# EAGLE design Natcar 1.01 (EAGLE 7.2.0)
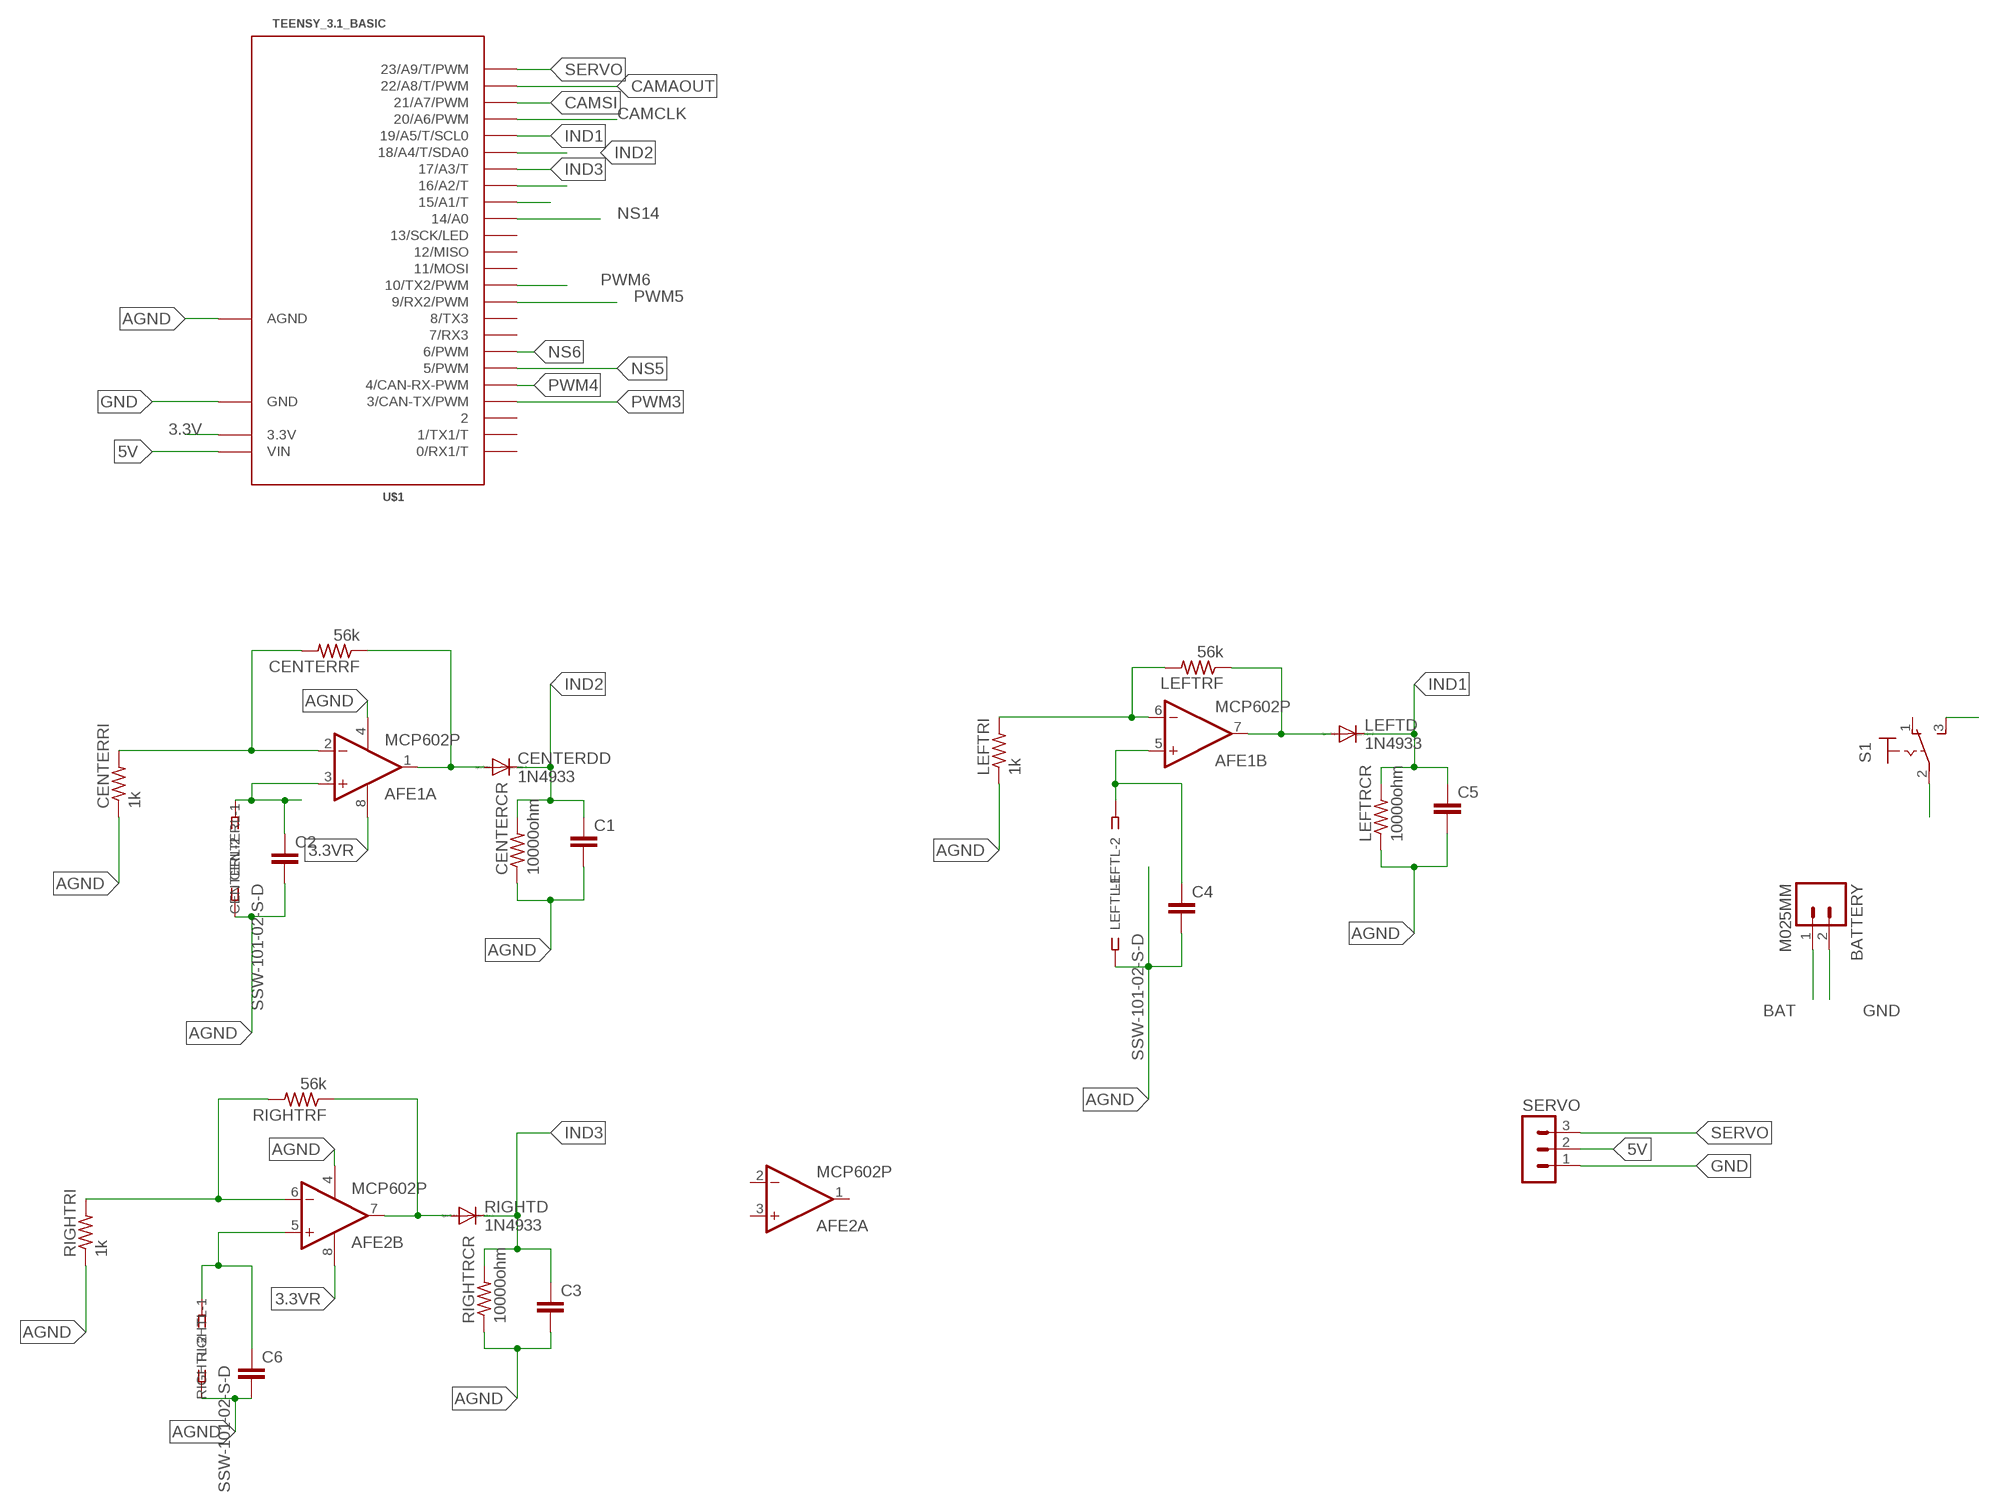
[diagram p0: schematic, sheet 1, part 1 of 2]
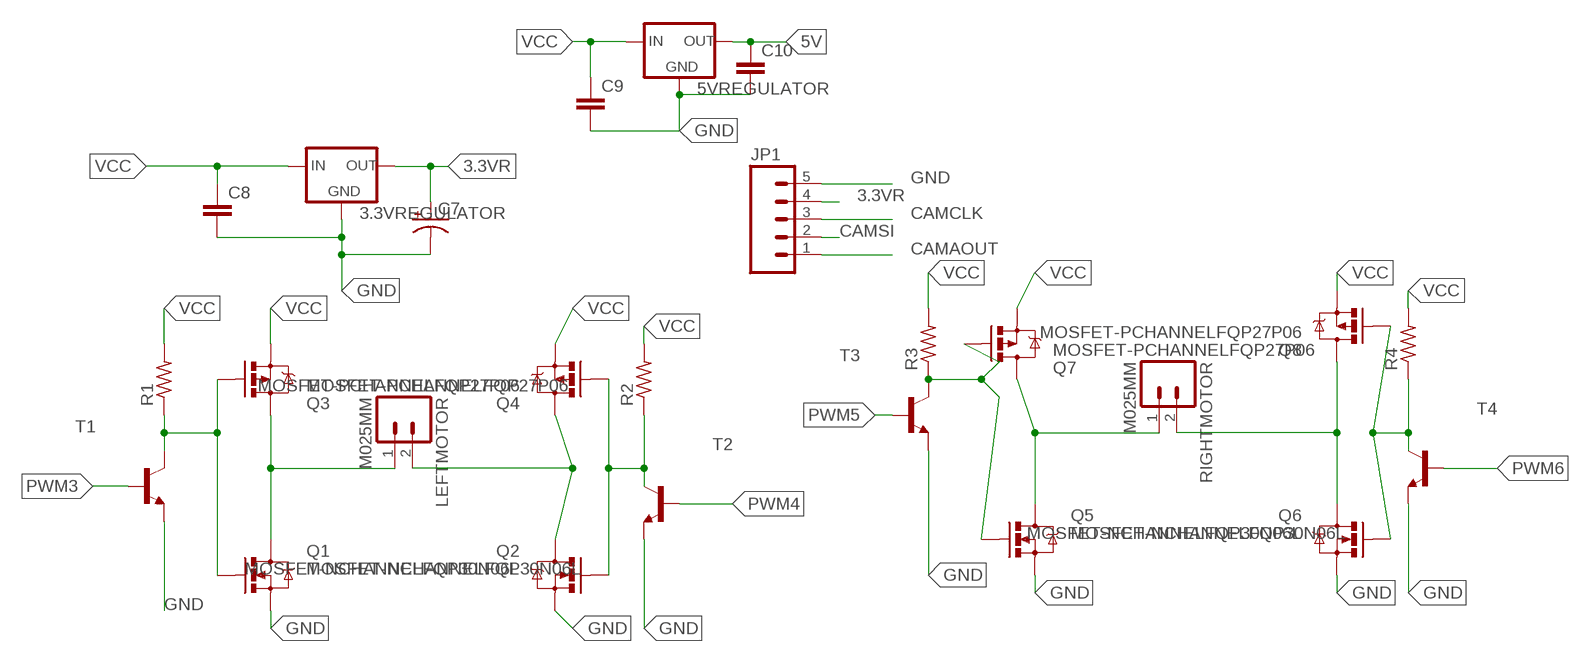
[diagram p1: schematic, sheet 1, part 2 of 2]

## Parts
3.3VREGULATOR  V_REG_78XXSINK  [TO220-IGO]
5VREGULATOR  V_REG_78XXSINK  [TO220-IGO]
AFE1  MCP602P  [DIL08]
AFE2  MCP602P  [DIL08]
BATTERY  M025MM  [SCREWTERMINAL-5MM-2]
C1  CAPEZ  [CAP-PTH-SMALLEZ]
C2  CAPEZ  [CAP-PTH-SMALLEZ]
C3  CAPEZ  [CAP-PTH-SMALLEZ]
C4  CAPEZ  [CAP-PTH-SMALLEZ]
C5  CAPEZ  [CAP-PTH-SMALLEZ]
C6  CAPEZ  [CAP-PTH-SMALLEZ]
C7  CAP_POLPTH2  [CPOL-RADIAL-10UF-25V]
C8  CAPPTH2  [CAP-PTH-SMALL2]
C9  CAPPTH2  [CAP-PTH-SMALL2]
C10  CAPPTH2  [CAP-PTH-SMALL2]
CENTERCR  10000ohm  R-US_0204/5  [0204/5]
CENTERDD  1N4933  [DO41-10]
CENTERL  SSW-101-02-S-D  [SSW-101-02-S-D]
CENTERRF  56k  R-US_0204/5  [0204/5]
CENTERRI  1k  R-US_0204/5  [0204/5]
JP1  M05PTH  [1X05]
LEFTD  1N4933  [DO41-10]
LEFTL  SSW-101-02-S-D  [SSW-101-02-S-D]
LEFTMOTOR  M025MM  [SCREWTERMINAL-5MM-2]
LEFTRCR  10000ohm  R-US_0204/5  [0204/5]
LEFTRF  56k  R-US_0204/5  [0204/5]
LEFTRI  1k  R-US_0204/5  [0204/5]
Q1  MOSFET-NCHANNELFQP30N06L  [TO220V]
Q2  MOSFET-NCHANNELFQP30N06L  [TO220V]
Q3  MOSFET-PCHANNELFQP27P06  [TO220V]
Q4  MOSFET-PCHANNELFQP27P06  [TO220V]
Q5  MOSFET-NCHANNELFQP30N06L  [TO220V]
Q6  MOSFET-NCHANNELFQP30N06L  [TO220V]
Q7  MOSFET-PCHANNELFQP27P06  [TO220V]
Q8  MOSFET-PCHANNELFQP27P06  [TO220V]
R1  R-US_0204/5  [0204/5]
R2  R-US_0204/5  [0204/5]
R3  R-US_0204/5  [0204/5]
R4  R-US_0204/5  [0204/5]
RIGHTD  1N4933  [DO41-10]
RIGHTL  SSW-101-02-S-D  [SSW-101-02-S-D]
RIGHTMOTOR  M025MM  [SCREWTERMINAL-5MM-2]
RIGHTRCR  10000ohm  R-US_0204/5  [0204/5]
RIGHTRF  56k  R-US_0204/5  [0204/5]
RIGHTRI  1k  R-US_0204/5  [0204/5]
S1  320-916  [320-916]
SERVO  MA03-1  [MA03-1]
T1  -NPN-TO92-EBC  [TO92-EBC]
T2  -NPN-TO92-EBC  [TO92-EBC]
T3  -NPN-TO92-EBC  [TO92-EBC]
T4  -NPN-TO92-EBC  [TO92-EBC]
U$1  TEENSY_3.1_BASIC  [TEENSY_3.1_BASIC]

## Nets
3.3V: U$1.3.3V
3.3VR: 3.3VREGULATOR.OUT AFE1.8(P:V+) AFE2.8(P:V+) C7.1(+) JP1.4
5V: 5VREGULATOR.OUT C10.1 SERVO.2 U$1.VIN
AGND: AFE1.4(P:V-) AFE2.4(P:V-) C1.2 C2.2 C3.2 C4.2 C5.2 C6.2 CENTERCR.1 CENTERL.1 CENTERRI.1 LEFTL.1 LEFTRCR.1 LEFTRI.1 RIGHTL.1 RIGHTRCR.1 RIGHTRI.1 U$1.AGND
BAT: BATTERY.1 S1.3(S)
CAMAOUT: JP1.1 U$1.22/A8(22/A8/T/PWM)
CAMCLK: JP1.3 U$1.20/A6(20/A6/PWM)
CAMSI: JP1.2 U$1.21/A7(21/A7/PWM)
GND: 3.3VREGULATOR.GND 5VREGULATOR.GND BATTERY.2 C7.2(-) C8.2 C9.2 C10.2 JP1.5 Q1.3(S) Q2.3(S) Q5.3(S) Q6.3(S) SERVO.1 T1.E T2.E T3.E T4.E U$1.GND
IND1: C5.1 LEFTD.C LEFTRCR.2 U$1.19/A5(19/A5/T/SCL0)
IND2: C1.1 CENTERCR.2 CENTERDD.C U$1.18/A4(18/A4/T/SDA0)
IND3: C3.1 RIGHTD.C RIGHTRCR.2 U$1.17/A3(17/A3/T)
N$1: LEFTMOTOR.2 Q2.2(D) Q4.2(D)
N$2: Q2.1(G) Q4.1(G) R2.1 T2.C
N$3: Q5.2(D) Q7.2(D) RIGHTMOTOR.1
N$4: Q6.2(D) Q8.2(D) RIGHTMOTOR.2
N$5: Q1.1(G) Q3.1(G) R1.1 T1.C
N$6: Q5.1(G) Q7.1(G) R3.1 T3.C
N$7: Q6.1(G) Q8.1(G) R4.1 T4.C
N$8: LEFTMOTOR.1 Q1.2(D) Q3.2(D)
N$9: AFE2.6(B:-IN) RIGHTRF.2 RIGHTRI.2
N$10: AFE2.7(B:OUT) RIGHTD.A RIGHTRF.1
N$11: U$1.15/A1(15/A1/T)
N$12: AFE1.2(A:-IN) CENTERRF.2 CENTERRI.2
N$13: AFE1.3(A:+IN) C2.1 CENTERL.2
N$14: U$1.16/A2(16/A2/T)
N$17: AFE2.5(B:+IN) C6.1 RIGHTL.2
N$19: AFE1.1(A:OUT) CENTERDD.A CENTERRF.1
N$20: AFE1.7(B:OUT) LEFTD.A LEFTRF.1
N$21: AFE1.5(B:+IN) C4.1 LEFTL.2
N$22: AFE1.6(B:-IN) LEFTRF.2 LEFTRI.2
NS5: U$1.5(5/PWM)
NS6: U$1.6(6/PWM)
NS14: U$1.14/A0
PWM3: T1.B U$1.3(3/CAN-TX/PWM)
PWM4: T2.B U$1.4(4/CAN-RX-PWM)
PWM5: T3.B U$1.9(9/RX2/PWM)
PWM6: T4.B U$1.10(10/TX2/PWM)
SERVO: SERVO.3 U$1.23/A9(23/A9/T/PWM)
VCC: 3.3VREGULATOR.IN 5VREGULATOR.IN C8.1 C9.1 Q3.3(S) Q4.3(S) Q7.3(S) Q8.3(S) R1.2 R2.2 R3.2 R4.2 S1.2(P)
Unconnected: AFE2.1(A:OUT) AFE2.2(A:-IN) AFE2.3(A:+IN) S1.1(O) U$1.0(0/RX1/T) U$1.1(1/TX1/T) U$1.2 U$1.7(7/RX3) U$1.8(8/TX3) U$1.11(11/MOSI) U$1.12(12/MISO) U$1.13(13/SCK/LED)

## Library data of the parts
3.3VREGULATOR 5VREGULATOR = SparkFun-PowerIC:V_REG_78XX: Voltage Regulator Standard 7805 5V regulator. IGO (Input Ground Output). Spark Fun Electronics SKU : COM-00107
AFE1 AFE2 = linear:MCP602: Single Op Amp 2.7V to 6.0V Single Supply CMOS Source: http://ww1.microchip.com/downloads/en/DeviceDoc/21314g.pdf
BATTERY LEFTMOTOR RIGHTMOTOR = SparkFun-Connectors:M02: Standard 2-pin 0.1" header. Use with - straight break away headers ( PRT-00116) - right angle break away headers (PRT-00553) - swiss pins (PRT-00743) - machine pins (PRT-00117) - female headers (PRT-00115) Molex polarized connector foot print use with: PRT-08233 with associated crimp pins and housings. 2.54_SCREWTERM for use with PRT-10571. 3.5mm Screw Terminal footprints for PRT-08084 5mm Screw Terminal footprints for use with PRT-08432; STOREFRONT_ID: PRT-08432
C1-C6 C8-C10 = SparkFun-Passives:CAP: Capacitor Standard 0603 ceramic capacitor, and 0.1" leaded capacitor.
C7 = SparkFun-Passives:CAP_POL: Capacitor Polarized These are standard SMD and PTH capacitors. Normally 10uF, 47uF, and 100uF in electrolytic and tantalum varieties. Always verify the external diameter of the through hole cap, it varies with capacity, voltage, and manufacturer. The EIA devices should be standard.
CENTERCR CENTERRF CENTERRI LEFTRCR LEFTRF LEFTRI R1-R4 RIGHTRCR RIGHTRF RIGHTRI = resistor:R-US_: RESISTOR, American symbol
CENTERDD LEFTD RIGHTD = diode:1N4933: DIODE fast recovery rectifier, 1A
CENTERL LEFTL RIGHTL = con-samtec:SSW-101-02-S-D: THROUGH-HOLE .025" SQ POST SOCKET Source: Samtec SSW.pdf; MPN: SSW-101-02-S-D; OC_FARNELL: unknown; OC_NEWARK: 82P1456
JP1 = SparkFun-Connectors:M05: Header 5 Standard 5-pin 0.1" header. Use with straight break away headers (SKU : PRT-00116), right angle break away headers (PRT-00553), swiss pins (PRT-00743), machine pins (PRT-00117), and female headers (PRT-00115). Molex polarized connector foot print use with SKU : PRT-08230 with associated crimp pins and housings.
Q1 Q2 Q5 Q6 = SparkFun-DiscreteSemi:MOSFET-NCHANNEL: Common NMOSFET Parts MFG P/N Store ID Prod ID FDD8780 TRANS-09984 SI7820DN TRANS-11055 FDS6630A IC-08089 2N7002PW TRANS-11151 FQP30N06L COM-10213 TRANS-10060 BSS123LT1G TRANS-08345 BSS138 TRANS-00830 BS170 2N7000; PROD_ID: TRANS-10060
Q3 Q4 Q7 Q8 = SparkFun-DiscreteSemi:MOSFET-PCHANNEL: Generic PMOSFET IRLML2244 - TRANS-11153 (SOT-23 -20V -4.3A) (1.Gate 2.Source 3.Drain) FQP27P06 - COM-10349 <http://www.sparkfun.com/products/10349> (TO-220 -60V -27A) (1.Gate 2.Source 3.Drain)
S1 = switch:320-916: TOGGLE SWITCH distributor RS Components
SERVO = con-lstb:MA03-1: PIN HEADER; OC_FARNELL: unknown; OC_NEWARK: unknown
T1-T4 = transistor:*-NPN-: NPN Transistror BF959 corrected 2008.03.06
U$1 = Modified teensy 3.1:TEENSY_3.1_BASIC: Footprint for Teensy 3.1 board using all pin connections on the outer perimeter

## Net classes
0 default: clearance 0.205 mm

## Board
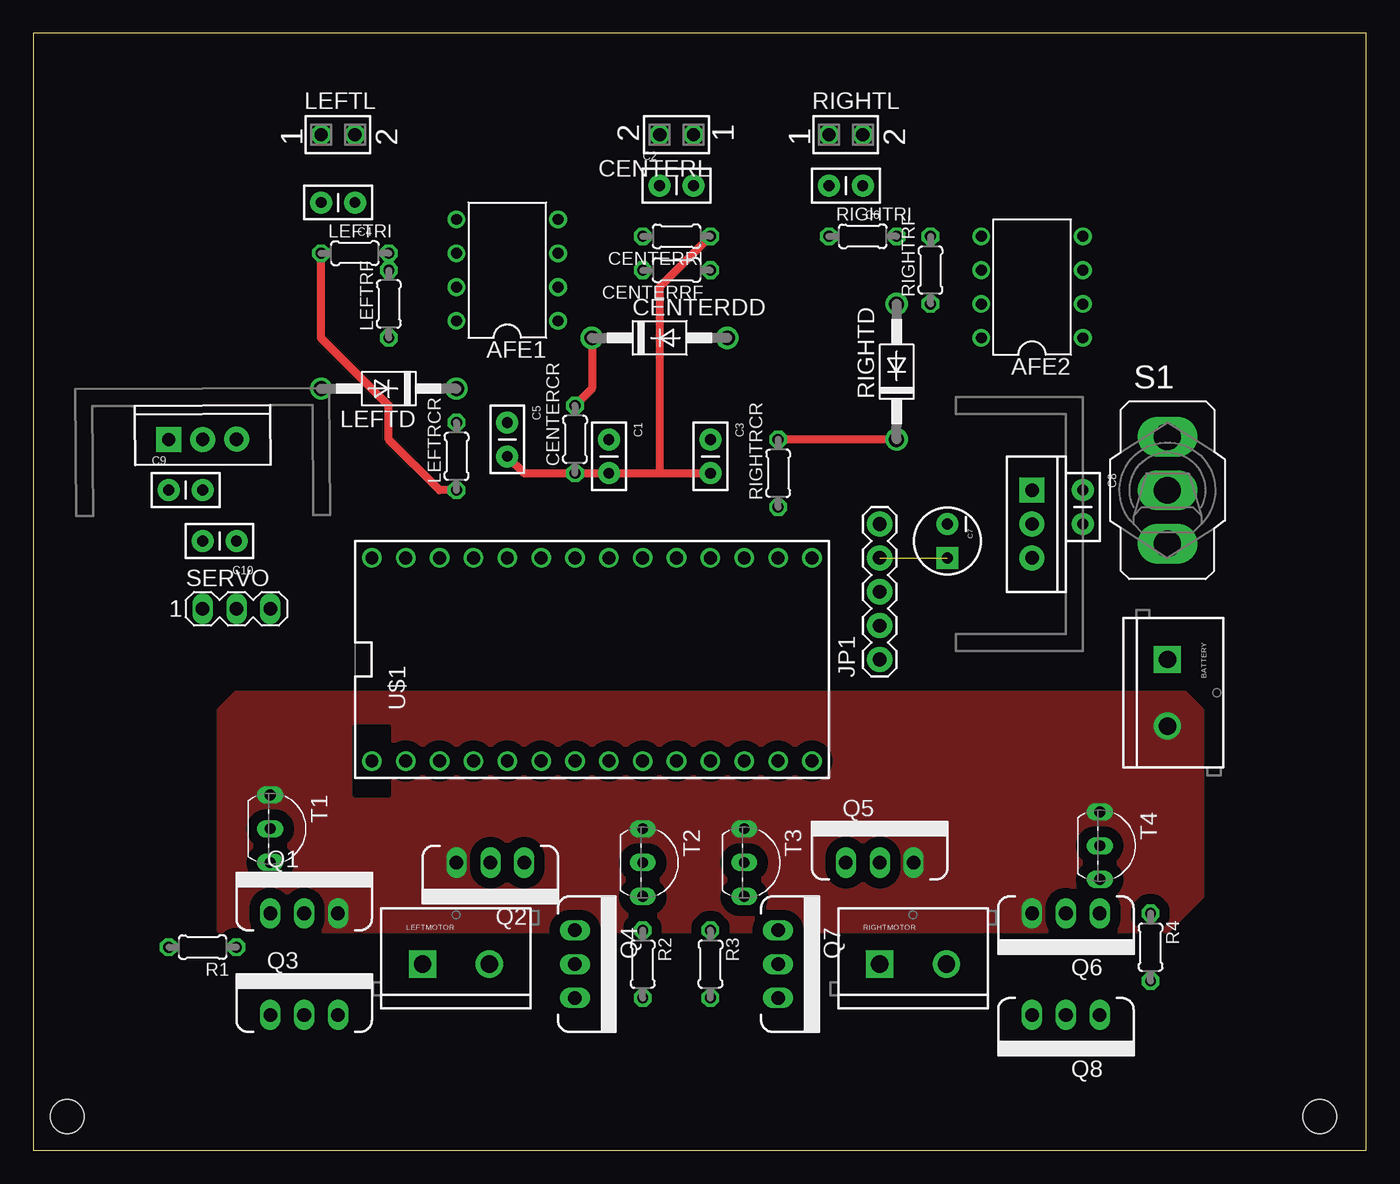
[diagram p2: board, top side]
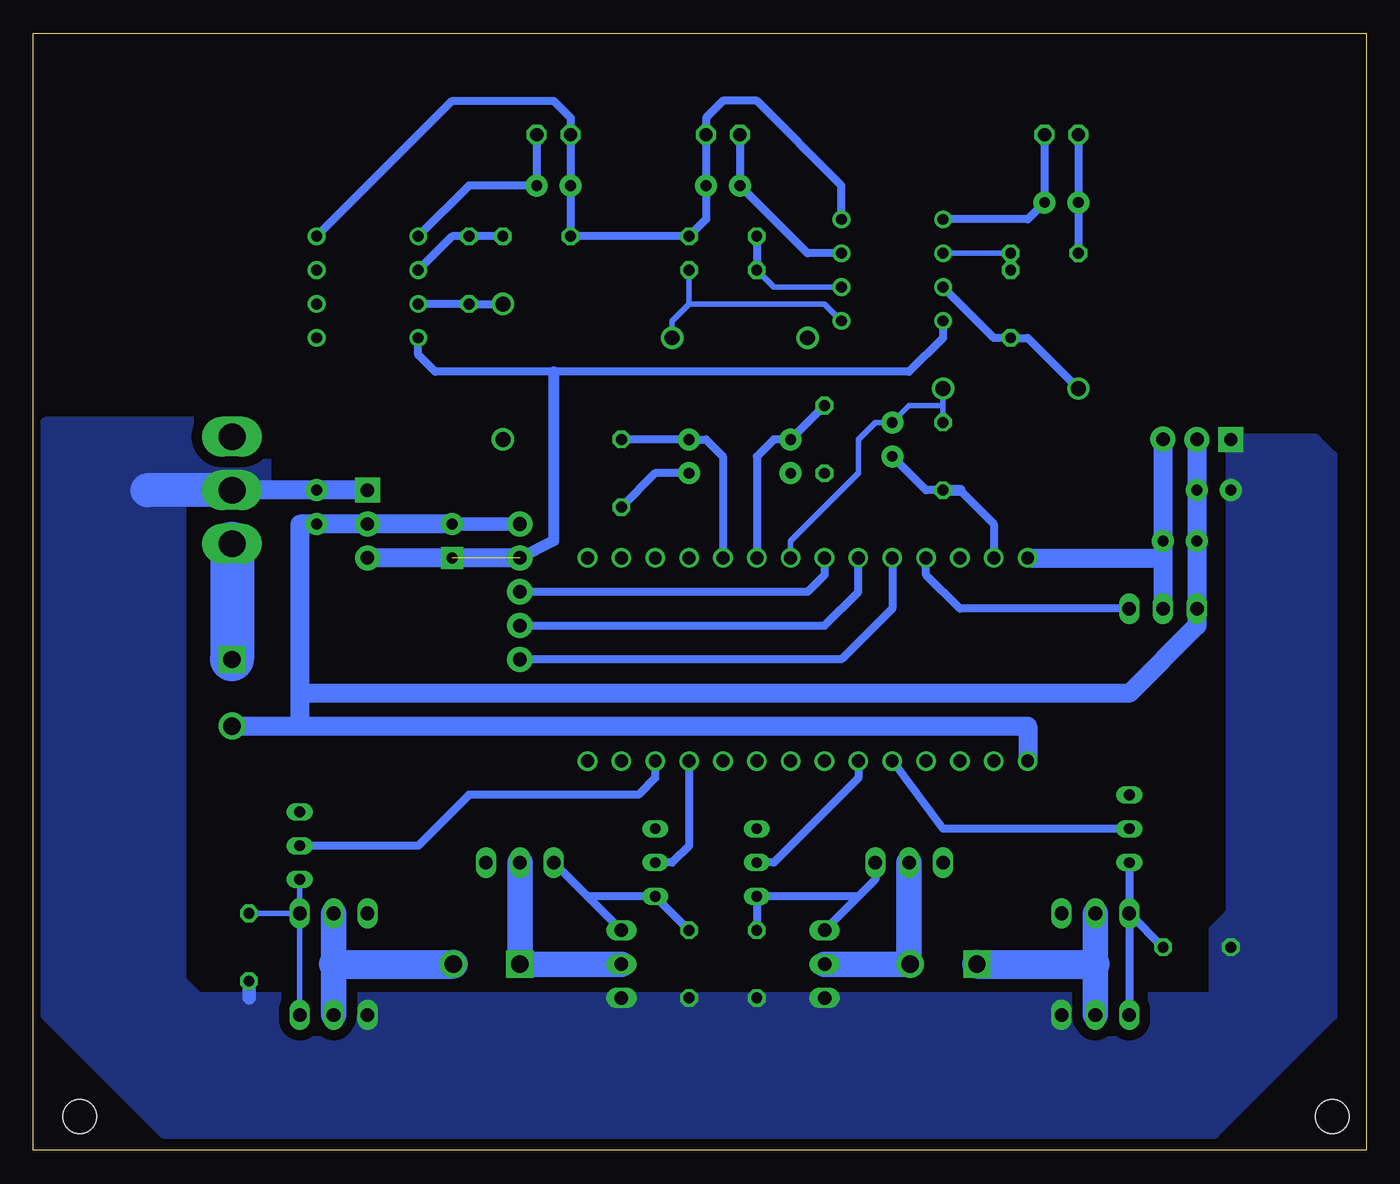
[diagram p3: board, bottom side, seen from below]

Size 100 x 83.81 mm. Coordinates in mm from the lower left corner, seen from the top.
Outline: 0,0 100,0 100,83.81 0,83.81 0,0
Copper layers (1*16): Top 0.035mm / dielectric 1.5mm / Bottom 0.035mm
Design rules "Othermill-DRC-1-32": minimum track width 8mil, minimum drill 0.8mm, track to track 0.794003125mm, track to pad 0.794003125mm, pad to pad 0.794003125mm, via to via 0.794003125mm, smd to smd 0mil, copper to edge 0mil, drill to drill 1mil, minimum pad ring 10mil, minimum via ring 10mil, stop-mask expansion 1mil, vias tented up to drill 30mil, thermal gap 10mil
Holes 2.54 mm at 2.54,2.54 96.52,2.54

### Footprints (pad centres in the part's own frame; a part is rotated, then mirrored left to right if it is on the bottom)
TO220-IGO = drill 1 pad 1.88: GND 0,0; OUT 2.54,0 | drill 1 pad 1.88 square: IN -2.54,0
DIL08 = drill 0.813 pad 1.27: 1 -3.81,-3.81; 2 -1.27,-3.81; 3 1.27,-3.81; 4 3.81,-3.81; 5 3.81,3.81; 6 1.27,3.81; 7 -1.27,3.81; 8 -3.81,3.81
SCREWTERMINAL-5MM-2 = drill 1.3 pad 2.032 square: 1 0,0 | drill 1.3 pad 2.032: 2 5,0
CAP-PTH-SMALLEZ = drill 0.813 pad 1.651: 1 0,0; 2 2.54,0
CPOL-RADIAL-10UF-25V = drill 0.813 pad 1.651 square: 1 1.27,0 | drill 0.813 pad 1.651: 2 -1.27,0
CAP-PTH-SMALL2 = drill 0.813 pad 1.651: 1 0,0; 2 2.54,0
0204/5 = drill 0.813 octagon: 1 -2.54,0; 2 2.54,0
DO41-10 = drill 1.118: A 5.08,0; C -5.08,0
SSW-101-02-S-D = drill 1 pad 1.5 octagon: 1 0,-1.27; 2 0,1.27
1X05 = drill 1.016 pad 1.88: 1 0,0; 2 2.54,0; 3 5.08,0; 4 7.62,0; 5 10.16,0
TO220V = drill 1.016 long: 1 -2.54,0; 2 0,0; 3 2.54,0
320-916 = drill 2.007 long: 1 0,4.013; 2 0,0; 3 0,-4.013
MA03-1 = drill 1.016 long: 1 -2.54,0; 2 0,0; 3 2.54,0
TO92-EBC = drill 0.813 long: B 0,-1.27; C 2.54,-1.27; E -2.54,-1.27
TEENSY_3.1_BASIC = drill 0.965: 0 -7.62,13.97; 1 -7.62,11.43; 2 -7.62,8.89; 3 -7.62,6.35; 3.3V 7.62,11.43; 4 -7.62,3.81; 5 -7.62,1.27; 6 -7.62,-1.27; 7 -7.62,-3.81; 8 -7.62,-6.35; 9 -7.62,-8.89; 10 -7.62,-11.43; 11 -7.62,-13.97; 12 -7.62,-16.51; 13 7.62,-16.51; 14/A0 7.62,-13.97; 15/A1 7.62,-11.43; 16/A2 7.62,-8.89; 17/A3 7.62,-6.35; 18/A4 7.62,-3.81; 19/A5 7.62,-1.27; 20/A6 7.62,1.27; 21/A7 7.62,3.81; 22/A8 7.62,6.35; 23/A9 7.62,8.89; AGND 7.62,13.97; GND -7.62,16.51; VIN 7.62,16.51

### Placement (x,y rotation side)
3.3VREGULATOR  74.93,46.99 270 top
5VREGULATOR  12.7,53.34 0.3 top
AFE1  35.56,66.04 90 top
AFE2  74.93,64.77 90 top
BATTERY  85.09,36.83 270 top
C1  43.18,53.34 270 top
C2  46.99,72.39 0 top
C3  50.8,53.34 270 top
C4  24.13,71.12 180 top
C5  35.56,54.61 270 top
C6  62.23,72.39 180 top
C7  68.58,45.72 270 top
C8  78.74,49.53 270 top
C9  10.16,49.53 0 top
C10  15.24,45.72 180 top
CENTERCR  40.64,53.34 90 top
CENTERDD  46.99,60.96 0 top
CENTERL  48.26,76.2 90 top
CENTERRF  48.26,66.04 180 top
CENTERRI  48.26,68.58 180 top
JP1  63.5,36.83 90 top
LEFTD  26.67,57.15 180 top
LEFTL  22.86,76.2 270 top
LEFTMOTOR  29.21,13.97 0 top
LEFTRCR  31.75,52.07 90 top
LEFTRF  26.67,63.5 90 top
LEFTRI  24.13,67.31 0 top
Q1  20.32,17.78 0 top
Q2  34.29,21.59 180 top
Q3  20.32,10.16 0 top
Q4  40.64,13.97 270 top
Q5  63.5,21.59 0 top
Q6  77.47,17.78 180 top
Q7  55.88,13.97 270 top
Q8  77.47,10.16 180 top
R1  12.7,15.24 180 top
R2  45.72,13.97 270 top
R3  50.8,13.97 270 top
R4  83.82,15.24 270 top
RIGHTD  64.77,58.42 90 top
RIGHTL  60.96,76.2 270 top
RIGHTMOTOR  63.5,13.97 0 top
RIGHTRCR  55.88,50.8 90 top
RIGHTRF  67.31,66.04 90 top
RIGHTRI  62.23,68.58 0 top
S1  85.09,49.53 0 top
SERVO  15.24,40.64 0 top
T1  19.05,24.13 270 top
T2  46.99,21.59 270 top
T3  54.61,21.59 270 top
T4  81.28,22.86 270 top
U$1  41.91,36.83 90 top

### Tracks (layer width: path | path; a pad name or v marks a point on that pad's centre or on a via)
3.3VR  (1 unrouted)
  Bottom 0.61: AFE1.8 31.75,60.96 34.29,58.42 60.96,58.42 69.85,58.42 71.12,59.69 AFE2.8
  Bottom 0.813: 60.96,58.42 60.96,45.72 JP1.4
  Bottom 1.422: JP1.4 3.3VREGULATOR.OUT
5V
  Bottom 1.422: U$1.VIN 15.24,44.45 | 5VREGULATOR.OUT C10.1 15.24,44.45 | 15.24,44.45 SERVO.2
AGND
  Top 0.61: LEFTRCR.1 30.48,49.53 26.67,53.34 26.67,55.88 21.59,60.96 LEFTRI.1 | C5.2 36.83,50.8 CENTERCR.1 C1.2 46.99,50.8 | 46.99,50.8 C3.2 | 46.99,50.8 46.99,64.77 CENTERRI.1
  Bottom 0.61: LEFTL.1 C4.2 LEFTRI.1 | LEFTRCR.1 33.02,49.53 C5.2 | RIGHTRCR.1 53.34,50.8 C3.2 | 30.48,49.53 27.94,46.99 U$1.AGND | AFE2.4 68.58,78.74 60.96,78.74 59.69,77.47 RIGHTL.1 C6.2 RIGHTRI.1 CENTERRI.1 49.53,69.85 C2.2 CENTERL.1 49.53,77.47 48.26,78.74 45.72,78.74 39.37,72.39 AFE1.4
  Bottom 0.813: LEFTRCR.1 30.48,49.53
BAT
  Bottom 3.302: S1.3 BATTERY.1
CAMAOUT
  Bottom 0.61: JP1.1 39.37,36.83 35.56,40.64 U$1.22/A8
CAMCLK
  Bottom 0.61: U$1.20/A6 40.64,43.18 41.91,41.91 JP1.3
CAMSI
  Bottom 0.61: U$1.21/A7 38.1,41.91 40.64,39.37 JP1.2
GND
  Bottom 1.016: JP1.5 C7.2
  Bottom 1.422: BATTERY.2 80.01,31.83 | 80.01,31.83 25.4,31.83 U$1.GND | 80.01,34.29 80.01,31.83 | 80.01,34.29 17.78,34.29 12.7,39.37 SERVO.1 C10.2 C9.2 5VREGULATOR.GND | 80.01,34.29 80.01,46.99 C8.2 3.3VREGULATOR.GND C7.2
  pour Top (no thermals): 86.36,34.29 15.24,34.29 13.97,33.02 13.97,16.51 85.09,16.51 87.63,19.05 87.63,33.02
IND1
  Bottom 0.406: U$1.19/A5 43.18,45.72 38.1,50.8 38.1,53.34 36.83,54.61 C5.1 34.29,55.88 31.75,55.88 | LEFTD.C 31.75,55.88 | 31.75,55.88 LEFTRCR.2
IND2
  Top 0.61: CENTERDD.C 41.91,57.15 CENTERCR.2
  Bottom 0.61: U$1.18/A4 45.72,52.07 44.45,53.34 C1.1 CENTERCR.2
IND3
  Top 0.61: RIGHTD.C RIGHTRCR.2
  Bottom 0.61: U$1.17/A3 48.26,52.07 49.53,53.34 C3.1 RIGHTRCR.2
N$1
  Bottom 1.676: LEFTMOTOR.2 34.29,13.97
  Bottom 1.93: Q2.2 34.29,13.97 Q4.2
N$2
  Bottom 0.61: Q2.1 36.83,20.32 38.1,19.05 | R2.1 T2.C 38.1,19.05 | Q4.1 38.1,19.05
N$3
  Bottom 1.93: Q5.2 RIGHTMOTOR.1 Q7.2
N$4
  Bottom 1.422: Q8.2 77.47,13.97
  Bottom 1.93: Q6.2 Q8.2
  Bottom 2.184: 77.47,13.97 RIGHTMOTOR.2
N$5
  Bottom 0.61: Q1.1 Q3.1 | T1.C Q1.1 | Q1.1 R1.1
N$6
  Bottom 0.61: R3.1 T3.C 58.42,19.05 | Q5.1 58.42,19.05 | 58.42,19.05 Q7.1
N$7
  Bottom 0.406: Q6.1 Q8.1 | Q6.1 R4.1 | T4.C Q6.1
N$8
  Bottom 1.93: Q1.2 20.32,13.97 Q3.2
  Bottom 2.184: LEFTMOTOR.1 20.32,13.97
N$9
  Bottom 0.61: AFE2.6 68.58,68.58 RIGHTRF.2 RIGHTRI.2
N$10
  Bottom 0.61: AFE2.7 RIGHTRF.1 RIGHTD.A
N$12
  Bottom 0.406: AFE1.2 44.45,64.77 CENTERRF.2
  Bottom 0.61: CENTERRI.2 CENTERRF.2
N$13
  Bottom 0.61: CENTERL.2 C2.1 41.91,67.31 AFE1.3
N$15
  cutout Top: 24.13,31.75 26.67,31.75 26.67,26.67 24.13,26.67
N$17
  Bottom 0.61: RIGHTL.2 C6.1 67.31,72.39 AFE2.5
N$19
  Bottom 0.406: AFE1.1 40.64,63.5 50.8,63.5 | 50.8,63.5 CENTERRF.1 | 50.8,63.5 52.07,62.23 CENTERDD.A
N$20
  Bottom 0.61: AFE1.7 27.94,60.96 LEFTRF.1 25.4,60.96 LEFTD.A
N$21
  Bottom 0.61: LEFTL.2 C4.1 25.4,69.85 AFE1.5
N$22
  Bottom 0.406: AFE1.6 LEFTRI.2 LEFTRF.2
PWM3
  Bottom 0.61: T1.B 31.75,24.13 U$1.3
PWM4
  Bottom 0.61: U$1.4 38.1,27.94 44.45,21.59 T2.B
PWM5
  Bottom 0.61: T3.B 52.07,21.59 50.8,22.86 U$1.9
PWM6
  Bottom 0.61: U$1.10 53.34,27.94 54.61,26.67 67.31,26.67 71.12,22.86 T4.B
SERVO
  Bottom 0.61: U$1.23/A9 33.02,43.18 30.48,40.64 SERVO.3
VCC
  Bottom 1.016: R4.2 83.82,11.43
  Bottom 1.422: 3.3VREGULATOR.IN C8.1 S1.2
  Bottom 2.54: S1.2 91.44,49.53
  pour Bottom (no thermals): 82.55,49.53 82.55,54.61 99.06,54.61 99.06,10.16 90.17,1.27 11.43,1.27 2.54,10.16 2.54,52.07 3.81,53.34 10.16,53.34 10.16,17.78 11.43,16.51 11.43,11.43 87.63,11.43 88.9,12.7 88.9,49.53